# Altium schematic sheet Body.SchDoc
size A4; SheetNumber: 1; SheetTotal: 8
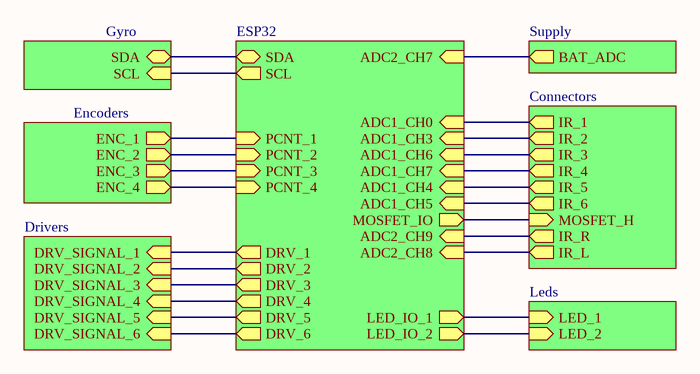
[diagram p0: Body.SchDoc]

## Sub-sheets
Connectors = Connectors: MOSFET_H (in), IR_1 (out), IR_2 (out), IR_3 (out), IR_4 (out), IR_5 (out), IR_6 (out), IR_R (out), IR_L (out)
Drivers = Drivers: DRV_SIGNAL_1 (in), DRV_SIGNAL_2 (in), DRV_SIGNAL_3 (in), DRV_SIGNAL_4 (in), DRV_SIGNAL_5 (in), DRV_SIGNAL_6 (in)
Encoders = Encoders: ENC_1 (out), ENC_2 (out), ENC_3 (out), ENC_4 (out)
ESP32 = ESP32: ADC1_CH0 (in), ADC1_CH3 (in), ADC1_CH4 (in), ADC1_CH5 (in), ADC1_CH6 (in), ADC1_CH7 (in), MOSFET_IO (out), DRV_1 (out), DRV_2 (out), DRV_3 (out), DRV_4 (out), DRV_5 (out), DRV_6 (out), SCL (out), SDA (bidir), ADC2_CH8 (in), PCNT_1 (in), PCNT_2 (in), PCNT_3 (in), PCNT_4 (in), LED_IO_1 (out), LED_IO_2 (out), ADC2_CH7 (in), ADC2_CH9 (in)
Gyro = Gyro: SDA (bidir), SCL (in)
Leds = Leds: LED_1 (in), LED_2 (in)
Supply = Supply: BAT_ADC (out)

## Nets
(unnamed): sheet ESP32/ADC1_CH0, sheet Connectors/IR_1
(unnamed): sheet ESP32/ADC1_CH3, sheet Connectors/IR_2
(unnamed): sheet ESP32/ADC1_CH4, sheet Connectors/IR_5
(unnamed): sheet ESP32/ADC1_CH5, sheet Connectors/IR_6
(unnamed): sheet ESP32/ADC1_CH6, sheet Connectors/IR_3
(unnamed): sheet ESP32/ADC1_CH7, sheet Connectors/IR_4
(unnamed): sheet ESP32/MOSFET_IO, sheet Connectors/MOSFET_H
(unnamed): sheet ESP32/DRV_1, sheet Drivers/DRV_SIGNAL_1
(unnamed): sheet ESP32/DRV_2, sheet Drivers/DRV_SIGNAL_2
(unnamed): sheet ESP32/DRV_3, sheet Drivers/DRV_SIGNAL_3
(unnamed): sheet ESP32/DRV_4, sheet Drivers/DRV_SIGNAL_4
(unnamed): sheet ESP32/DRV_5, sheet Drivers/DRV_SIGNAL_5
(unnamed): sheet ESP32/DRV_6, sheet Drivers/DRV_SIGNAL_6
(unnamed): sheet ESP32/SCL, sheet Gyro/SCL
(unnamed): sheet ESP32/SDA, sheet Gyro/SDA
(unnamed): sheet ESP32/ADC2_CH8, sheet Connectors/IR_L
(unnamed): sheet ESP32/PCNT_1, sheet Encoders/ENC_1
(unnamed): sheet ESP32/PCNT_2, sheet Encoders/ENC_2
(unnamed): sheet ESP32/PCNT_3, sheet Encoders/ENC_3
(unnamed): sheet ESP32/PCNT_4, sheet Encoders/ENC_4
(unnamed): sheet ESP32/LED_IO_1, sheet Leds/LED_1
(unnamed): sheet ESP32/LED_IO_2, sheet Leds/LED_2
(unnamed): sheet ESP32/ADC2_CH7, sheet Supply/BAT_ADC
(unnamed): sheet ESP32/ADC2_CH9, sheet Connectors/IR_R